# EAGLE design boombox_routed (EAGLE 6.0)
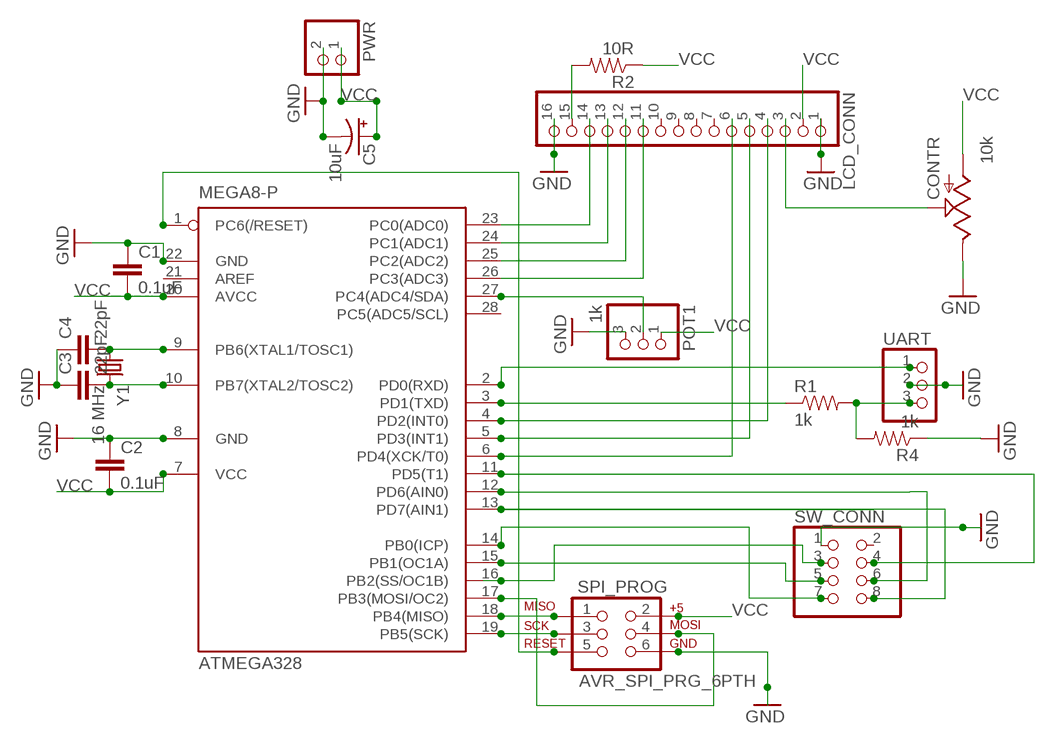
[diagram p0: schematic, sheet 1]

## Parts
ATMEGA328  MEGA8-P  [DIL28-3]
C1  0.1uF  C2.5/2  [C2.5-2]
C2  0.1uF  C2.5/2  [C2.5-2]
C3  22pF  C2.5/2  [C2.5-2]
C4  22pF  C2.5/2  [C2.5-2]
C5  10uF  CAP_POLPTH2  [CPOL-RADIAL-10UF-25V]
CONTR  10k  POT100K_3362U  [3362U]
LCD_CONN  PINHD-1X16  [1X16]
POT1  1k  PINHD-1X3  [1X03]
PWR  PINHD-1X2  [1X02]
R1  1k  RESISTORPTH-1/4W  [AXIAL-0.4]
R2  10R  RESISTORPTH-1/4W  [AXIAL-0.4]
R4  1k  RESISTORPTH-1/4W  [AXIAL-0.4]
SPI_PROG  AVR_SPI_PRG_6PTH  [2X3]
SW_CONN  PINHD-2X4  [2X04]
UART  PINHD-1X3  [1X03]
Y1  16 MHz  CRYSTALHC49US  [HC49US]

## Nets
GND: ATMEGA328.8(GND) ATMEGA328.22(GND) C1.1 C2.1 C3.1 C4.1 C5.2(-) CONTR.P$1(E) LCD_CONN.1 LCD_CONN.16 POT1.3 PWR.2 R4.P$1 SPI_PROG.6 SW_CONN.1 UART.2
N$1: ATMEGA328.10(PB7(XTAL2/TOSC2)) C3.2 Y1.2
N$2: ATMEGA328.9(PB6(XTAL1/TOSC1)) C4.2 Y1.1
N$3: CONTR.P$2(S) LCD_CONN.3
N$4: ATMEGA328.3(PD1(TXD)) R1.P$1
N$5: R1.P$2 R4.P$2 UART.3
N$6: ATMEGA328.2(PD0(RXD)) UART.1
N$7: ATMEGA328.4(PD2(INT0)) LCD_CONN.4
N$8: ATMEGA328.5(PD3(INT1)) LCD_CONN.5
N$9: ATMEGA328.6(PD4(XCK/T0)) LCD_CONN.6
N$10: LCD_CONN.15 R2.P$2
N$11: ATMEGA328.23(PC0(ADC0)) LCD_CONN.14
N$12: ATMEGA328.24(PC1(ADC1)) LCD_CONN.13
N$13: ATMEGA328.25(PC2(ADC2)) LCD_CONN.12
N$14: ATMEGA328.26(PC3(ADC3)) LCD_CONN.11
N$16: ATMEGA328.19(PB5(SCK)) SPI_PROG.3
N$17: ATMEGA328.18(PB4(MISO)) SPI_PROG.1
N$18: ATMEGA328.17(PB3(MOSI/OC2)) SPI_PROG.4
N$19: ATMEGA328.14(PB0(ICP)) SW_CONN.7
N$20: ATMEGA328.27(PC4(ADC4/SDA)) POT1.2
N$21: ATMEGA328.15(PB1(OC1A)) SW_CONN.5
N$22: ATMEGA328.12(PD6(AIN0)) SW_CONN.6
N$23: ATMEGA328.13(PD7(AIN1)) SW_CONN.8
N$24: ATMEGA328.11(PD5(T1)) SW_CONN.4
N$25: ATMEGA328.16(PB2(SS/OC1B)) SW_CONN.3
N$27: ATMEGA328.1(PC6(/RESET)) SPI_PROG.5
VCC: ATMEGA328.7(VCC) ATMEGA328.20(AVCC) C1.2 C2.2 C5.1(+) CONTR.P$3(A) LCD_CONN.2 POT1.1 PWR.1 R2.P$1 SPI_PROG.2
Unconnected: ATMEGA328.21(AREF) ATMEGA328.28(PC5(ADC5/SCL)) LCD_CONN.7 LCD_CONN.8 LCD_CONN.9 LCD_CONN.10 SW_CONN.2

## Library data of the parts
ATMEGA328 = atmel:MEGA8-P: MICROCONTROLLER 8 Kbytes FLASH, 1 kbytes SRAM, 512 bytes EEPROM, USART, 4-channel 10 bit ADC, 2-channel 8 bit ADC Pin compatible with Atmega48, ATMega88, ATMega168 Source: avr.lbr; OC_FARNELL: unknown; OC_NEWARK: unknown
C1-C4 = capacitor-wima:C: CAPACITOR naming: grid - package width
C5 = SparkFun:CAP_POL: Capacitor Polarized These are standard SMD and PTH capacitors. Normally 10uF, 47uF, and 100uF in electrolytic and tantalum varieties. Always verify the external diameter of the through hole cap, it varies with capacity, voltage, and manufacturer. The EIA devices should be standard.
CONTR = SparkFun:POT
LCD_CONN = pinhead:PINHD-1X16: PIN HEADER
POT1 UART = pinhead:PINHD-1X3: PIN HEADER
PWR = pinhead:PINHD-1X2: PIN HEADER
R1 R2 R4 = SparkFun:RESISTOR: Resistor Basic schematic elements and footprints for 0603, 1206, and PTH resistors.
SPI_PROG = SparkFun:AVR_SPI_PRG_6: AVR ISP 6 Pin This is the reduced ISP connector for AVR programming. Common on Arduino. This footprint will take up less PCB space and can be used with a 10-pin to 6-pin adapter such as SKU: BOB-08508
SW_CONN = pinhead:PINHD-2X4: PIN HEADER
Y1 = SparkFun:CRYSTAL: Crystals Various standard crystals. Proven footprints. Spark Fun Electronics SKU : COM-00534

## Board
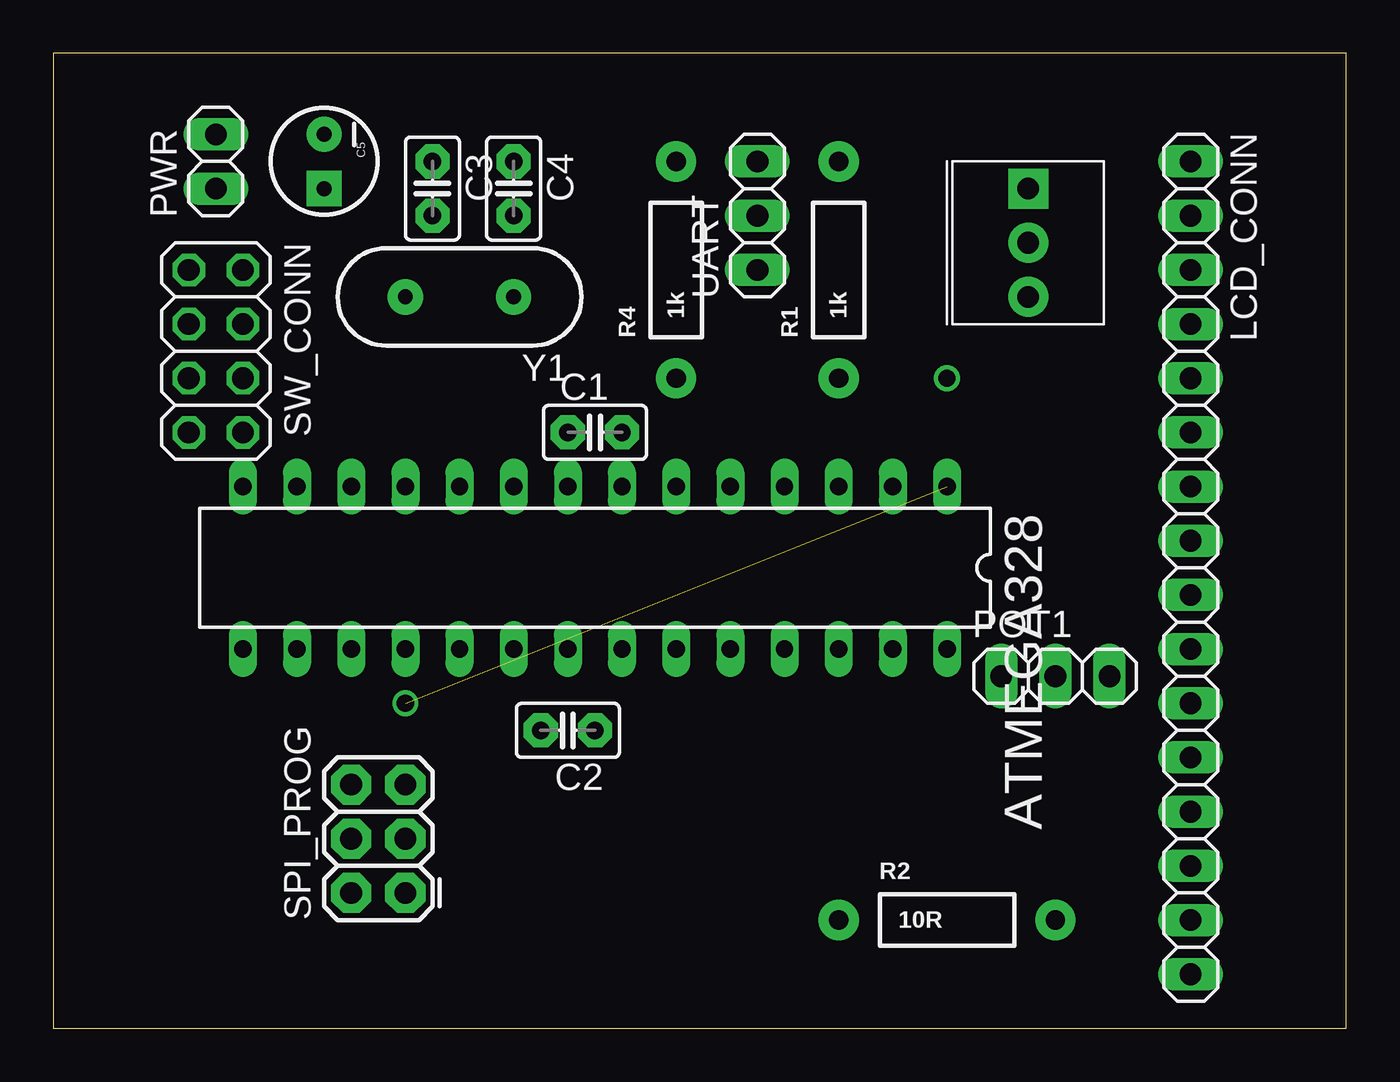
[diagram p1: board, top side]
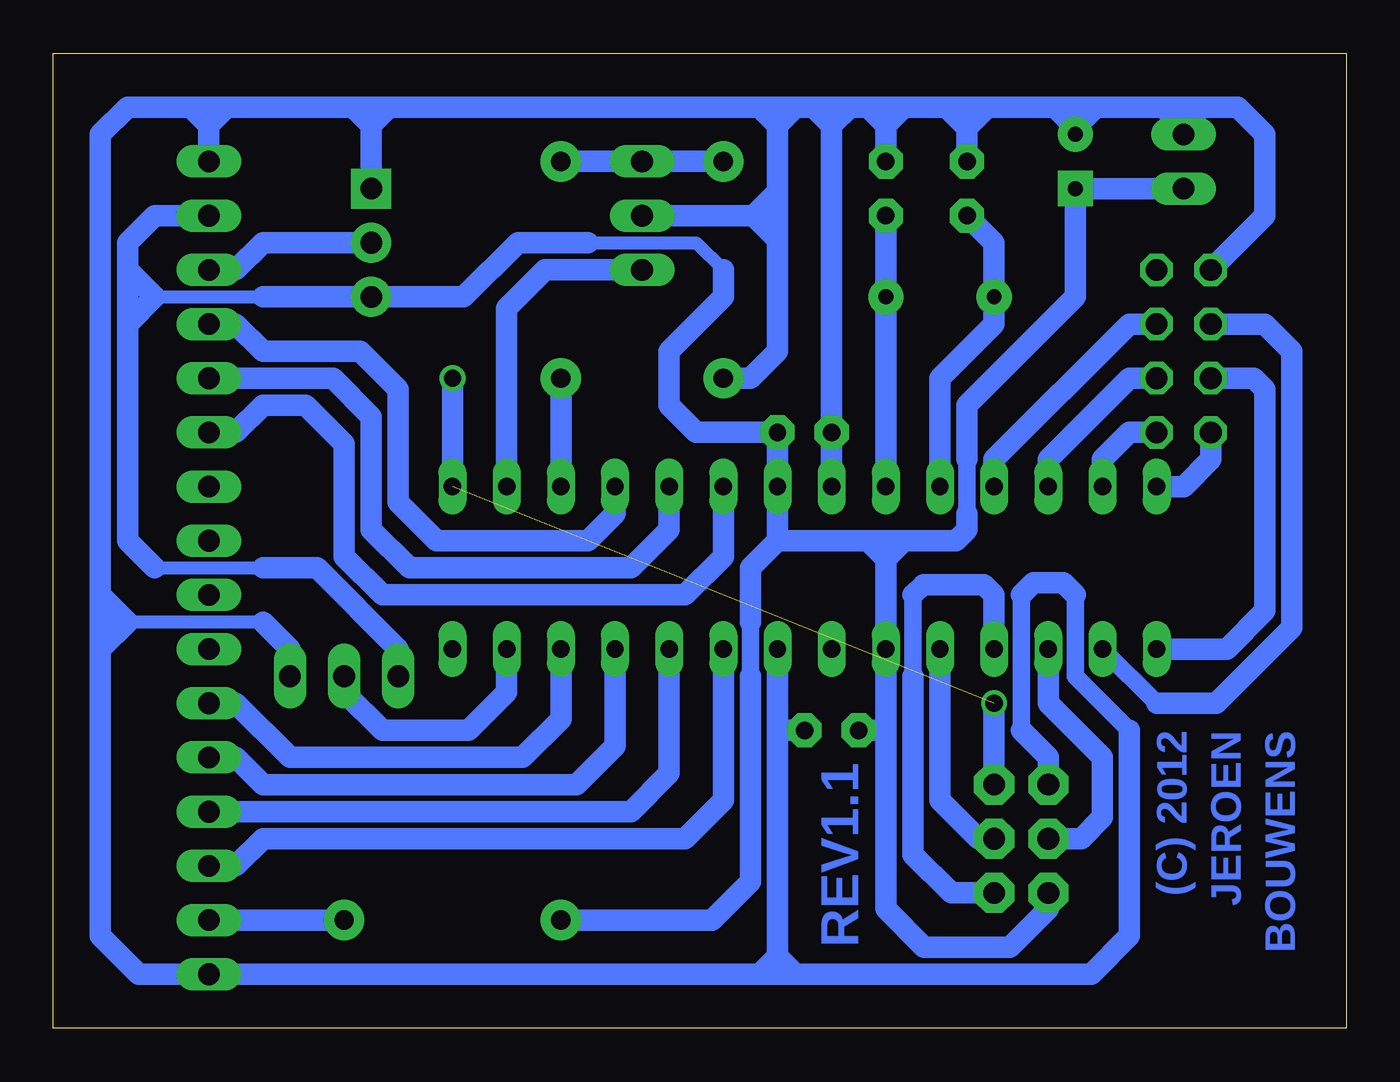
[diagram p2: board, bottom side, seen from below]

Size 60.63 x 45.71 mm. Coordinates in mm from the lower left corner, seen from the top.
Outline: 0,0 60.63,0 60.63,45.71 0,45.71 0,0
Copper layers (1*16): Top 0.035mm / dielectric 1.5mm / Bottom 0.035mm
Design rules: minimum track width 10mil, minimum drill 24mil, track to track 8mil, track to pad 8mil, pad to pad 8mil, via to via 8mil, smd to smd 8mil, copper to edge 40mil, drill to drill 8mil, minimum pad ring 10mil, minimum via ring 8mil, stop-mask expansion 4mil, vias tented up to drill 0mil, thermal gap 10mil

### Footprints (pad centres in the part's own frame; a part is rotated, then mirrored left to right if it is on the bottom)
DIL28-3 = drill 0.813 long: 1 -16.51,-3.81; 2 -13.97,-3.81; 3 -11.43,-3.81; 4 -8.89,-3.81; 5 -6.35,-3.81; 6 -3.81,-3.81; 7 -1.27,-3.81; 8 1.27,-3.81; 9 3.81,-3.81; 10 6.35,-3.81; 11 8.89,-3.81; 12 11.43,-3.81; 13 13.97,-3.81; 14 16.51,-3.81; 15 16.51,3.81; 16 13.97,3.81; 17 11.43,3.81; 18 8.89,3.81; 19 6.35,3.81; 20 3.81,3.81; 21 1.27,3.81; 22 -1.27,3.81; 23 -3.81,3.81; 24 -6.35,3.81; 25 -8.89,3.81; 26 -11.43,3.81; 27 -13.97,3.81; 28 -16.51,3.81
C2.5-2 = drill 0.813 pad 1.6 octagon: 1 -1.27,0; 2 1.27,0
CPOL-RADIAL-10UF-25V = drill 0.7 pad 1.651 square: 1 1.27,0 | drill 0.7 pad 1.651: 2 -1.27,0
3362U = drill 1.016 pad 1.88 square: P$1 0,2.54 | drill 1.016 pad 1.88: P$2 2.54,2.54; P$3 5.08,2.54
1X16 = drill 1.016 long: 1 -19.05,0; 2 -16.51,0; 3 -13.97,0; 4 -11.43,0; 5 -8.89,0; 6 -6.35,0; 7 -3.81,0; 8 -1.27,0; 9 1.27,0; 10 3.81,0; 11 6.35,0; 12 8.89,0; 13 11.43,0; 14 13.97,0; 15 16.51,0; 16 19.05,0
1X03 = drill 1.016 long: 1 -2.54,0; 2 0,0; 3 2.54,0
1X02 = drill 1.016 long: 1 -1.27,0; 2 1.27,0
AXIAL-0.4 = drill 0.9 pad 1.88: P$1 -5.08,0; P$2 5.08,0
2X3 = drill 1.016 pad 1.88 octagon: 1 0,0; 2 0,2.54; 3 2.54,0; 4 2.54,2.54; 5 5.08,0; 6 5.08,2.54
2X04 = drill 1.016 octagon: 1 -3.81,-1.27; 2 -3.81,1.27; 3 -1.27,-1.27; 4 -1.27,1.27; 5 1.27,-1.27; 6 1.27,1.27; 7 3.81,-1.27; 8 3.81,1.27
HC49US = drill 0.7 pad 1.651: 1 -2.54,0; 2 2.54,0

### Placement (x,y rotation side)
ATMEGA328  25.4,21.59 180 top
C1  25.4,27.94 0 top
C2  24.13,13.97 180 top
C3  17.78,39.37 270 top
C4  21.59,39.37 270 top
C5  12.7,40.64 270 top
CONTR  43.18,39.37 270 top
LCD_CONN  53.34,21.59 270 top
POT1  46.99,16.51 0 top
PWR  7.62,40.64 90 top
R1  36.83,35.56 90 top
R2  41.91,5.08 0 top
R4  29.21,35.56 90 top
SPI_PROG  16.51,6.35 90 top
SW_CONN  7.62,31.75 270 top
UART  33.02,38.1 90 top
Y1  19.05,34.29 180 top

### Tracks (layer width: path | path; a pad name or v marks a point on that pad's centre or on a via)
GND
  Bottom 0.406: 25.4,43.18 27.94,43.18 26.67,41.91 25.4,43.18 | 25.4,43.18 24.13,41.91 22.86,43.18 | 25.4,43.18 22.86,43.18 | 22.86,43.18 21.59,41.91 20.32,43.18 22.86,43.18 | PWR.2 6.35,43.18 | 45.72,41.91 46.99,43.18 44.45,43.18 45.72,41.91 | 54.61,43.18 53.34,41.91 52.07,43.18 54.61,43.18 | 26.67,3.81 27.94,2.54 25.4,2.54 26.67,3.81
  Bottom 0.61: 50.8,19.05 57.15,19.05 | PWR.2 8.89,43.18 | 11.43,43.18 C5.2 13.97,43.18 | 19.05,43.18 17.78,41.91 16.51,43.18
  Bottom 0.813: 15.24,13.97 15.24,20.32 | 12.7,20.32 12.7,16.51 10.16,13.97 | 27.94,38.1 26.67,36.83 26.67,39.37 27.94,38.1
  Bottom 1.016: ATMEGA328.22 26.67,13.97 | ATMEGA328.8 C1.1 24.13,41.91 24.13,43.18 | C2.1 26.67,13.97 | 26.67,13.97 26.67,3.81 26.67,2.54 | 26.67,2.54 25.4,2.54 11.96,2.54 10.16,4.34 10.16,13.97 | 26.67,2.54 27.94,2.54 LCD_CONN.16 56.62,2.54 58.42,4.34 58.42,17.78 | 7.62,43.18 PWR.2 | C3.1 17.78,41.91 17.78,43.18 | C4.1 21.59,41.91 21.59,43.18 | 26.67,38.1 26.67,36.83 26.67,31.75 27.94,30.48 R4.P$1 | UART.2 27.94,38.1 26.67,38.1 | 26.67,38.1 26.67,39.37 26.67,41.91 26.67,43.18 | 58.42,20.32 58.42,41.91 57.15,43.18 54.61,43.18 53.09,43.18 | 58.42,17.78 58.42,19.05 | SPI_PROG.6 13.97,12.7 15.24,13.97 | 12.7,20.32 13.26,20.88 14.68,20.88 15.24,20.32 | POT1.3 49.53,17.78 50.8,19.05 | 58.42,19.05 57.15,19.05 | 45.72,43.18 46.99,43.18 52.07,43.18 53.09,43.18 | 7.62,43.18 8.89,43.18 11.43,43.18 12.7,43.18 | 12.7,43.18 13.97,43.18 16.51,43.18 17.78,43.18 | 17.78,43.18 19.05,43.18 20.32,43.18 21.59,43.18 | 21.59,43.18 22.86,43.18 24.13,43.18 | 24.13,43.18 25.4,43.18 26.67,43.18 | 53.34,41.38 LCD_CONN.1 53.34,41.91 53.34,42.93 arc90 53.09,43.18 | 45.72,43.18 44.45,43.18 27.94,43.18 26.67,43.18 | CONTR.P$1 45.72,41.91 45.72,43.18 | 57.15,19.05 58.42,20.32 | 58.42,20.32 58.42,19.05 | 58.42,17.78 57.15,19.05 | SW_CONN.1 3.81,38.1 3.81,41.91 5.08,43.18 6.35,43.18 7.62,43.18 | 12.7,43.18 C5.2
N$1
  Bottom 1.016: 19.05,29.95 ATMEGA328.10 19.05,30.48 16.51,33.02 Y1.2 16.51,36.83 C3.2
N$2
  Bottom 1.016: C4.2 Y1.1 ATMEGA328.9
N$3
  Bottom 1.016: LCD_CONN.3 52.07,35.56 50.8,36.83 CONTR.P$2
N$4
  Bottom 1.016: ATMEGA328.3 R1.P$1
N$5
  Bottom 1.016: R1.P$2 UART.3 R4.P$2
N$6
  Bottom 1.016: UART.1 37.57,35.56 39.37,33.76 ATMEGA328.2
N$7
  Bottom 1.016: ATMEGA328.4 34.29,24.13 35.56,22.86 42.65,22.86 44.45,24.66 44.45,29.95 46.25,31.75 50.8,31.75 52.07,33.02 LCD_CONN.4
N$8
  Bottom 1.016: ATMEGA328.5 31.75,23.39 33.55,21.59 43.92,21.59 45.72,23.39 45.72,28.68 47.52,30.48 LCD_CONN.5
N$9
  Bottom 1.016: ATMEGA328.6 29.21,22.12 31.01,20.32 45.19,20.32 46.99,22.12 46.99,27.41 48.79,29.21 50.8,29.21 52.07,27.94 LCD_CONN.6
N$10
  Bottom 1.016: LCD_CONN.15 R2.P$2
N$11
  Bottom 1.016: LCD_CONN.14 52.07,7.62 50.8,8.89 31.01,8.89 29.21,10.69 ATMEGA328.23
N$12
  Bottom 1.016: LCD_CONN.13 33.55,10.16 31.75,11.96 ATMEGA328.24
N$13
  Bottom 1.016: LCD_CONN.12 52.07,12.7 50.8,11.43 36.09,11.43 34.29,13.23 ATMEGA328.25
N$14
  Bottom 1.016: LCD_CONN.11 52.07,15.24 49.53,12.7 38.63,12.7 36.83,14.5 ATMEGA328.26
N$16
  Bottom 1.016: ATMEGA328.19 19.05,10.69 17.25,8.89 SPI_PROG.3
N$17
  Bottom 0.813: 20.32,20.32 20.32,16.51
  Bottom 1.016: ATMEGA328.18 16.51,20.32 17,20.8 19.84,20.8 20.32,20.32 | SPI_PROG.1 18.52,6.35 20.32,8.15 20.32,16.51
N$18
  Bottom 1.016: ATMEGA328.17 13.97,15.24 11.43,12.7 11.43,9.89 12.43,8.89 SPI_PROG.4
N$19
  Bottom 1.016: SW_CONN.7 6.35,26.67 7.62,25.4 ATMEGA328.14
N$20
  Bottom 1.016: ATMEGA328.27 39.37,15.77 41.17,13.97 45.19,13.97 46.99,15.77 POT1.2
N$21
  Bottom 1.016: SW_CONN.5 4.34,30.48 3.81,29.95 3.81,19.58 5.61,17.78 ATMEGA328.15
N$22
  Bottom 1.016: ATMEGA328.12 13.97,26.67 10.16,30.48 SW_CONN.6
N$23
  Bottom 1.016: ATMEGA328.13 11.43,26.67 10.16,27.94 SW_CONN.8
N$24
  Bottom 1.016: SW_CONN.4 10.16,33.02 16.51,26.67 ATMEGA328.11
N$25
  Bottom 0.813: 8.89,15.24 ATMEGA328.16
  Bottom 1.016: 8.89,15.24 6.08,15.24 2.54,18.78 2.54,31.75 3.81,33.02 SW_CONN.3
N$27  (via drill 0.8 pad 0.81)  (1 unrouted)
  Bottom 1.016: ATMEGA328.1 v41.91,30.48 | v16.51,15.24 SPI_PROG.5
N$30
  pour Bottom: 26.67,3.81 27.94,2.54 25.4,2.54
VCC
  Bottom 0.406: 21.59,21.59 22.86,22.86 20.32,22.86 21.59,21.59
  Bottom 0.61: 35.56,36.83 30.48,36.83 29.21,35.56 | 55.88,21.59 50.8,21.59 | 55.88,34.29 50.8,34.29
  Bottom 0.813: 17.78,26.67 17.78,24.13 | 27.94,19.05 27.94,16.51
  Bottom 1.016: 21.59,13.97 ATMEGA328.20 21.59,21.59 21.59,22.86 | 21.59,13.97 C2.2 | 21.59,13.97 21.59,5.61 19.79,3.81 15.77,3.81 13.97,5.61 SPI_PROG.2 | 35.56,36.83 38.84,36.83 41.38,34.29 CONTR.P$3 50.8,34.29 | 26.67,22.86 ATMEGA328.7 C1.2 30.48,27.94 31.75,29.21 31.75,31.75 29.21,34.29 29.21,35.56 | 26.67,22.86 27.94,21.59 27.94,19.05 | 26.67,22.86 22.86,22.86 21.59,22.86 | 21.59,22.86 20.32,22.86 18.31,22.86 17.78,23.39 17.78,24.13 | R2.P$1 29.74,5.08 27.94,6.88 27.94,16.51 | PWR.1 C5.1 12.7,34.29 17.78,29.21 17.78,26.67 | LCD_CONN.2 55.88,38.1 57.15,36.83 57.15,35.56 | 50.8,21.59 48.26,21.59 44.45,17.78 POT1.1 | 57.15,33.02 57.15,22.86 55.88,21.59 | 57.15,35.56 55.88,34.29 57.15,33.02 | 57.15,33.02 57.15,35.56

### Text on the board
Bottom: BOUWENS | JEROEN | (C) 2012 | REV1.1